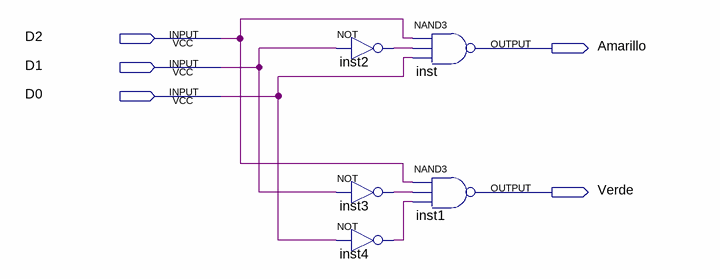
[diagram p0: schematic sheet]
// Quartus schematic Semaforo3.bdf as structural Verilog: 5 symbols, 5 pins
module Semaforo3 (
  input  D2,
  input  D1,
  input  D0,
  output Amarillo,
  output Verde
);

  wire inst2_out, inst3_out, inst4_out;

  not inst2 (inst2_out, D1);
  not inst3 (inst3_out, D1);
  not inst4 (inst4_out, D0);
  nand inst (Amarillo, D2, inst2_out, D0);
  nand inst1 (Verde, D2, inst3_out, inst4_out);
endmodule
